# EAGLE design rpi_hat (EAGLE 9.6.1)
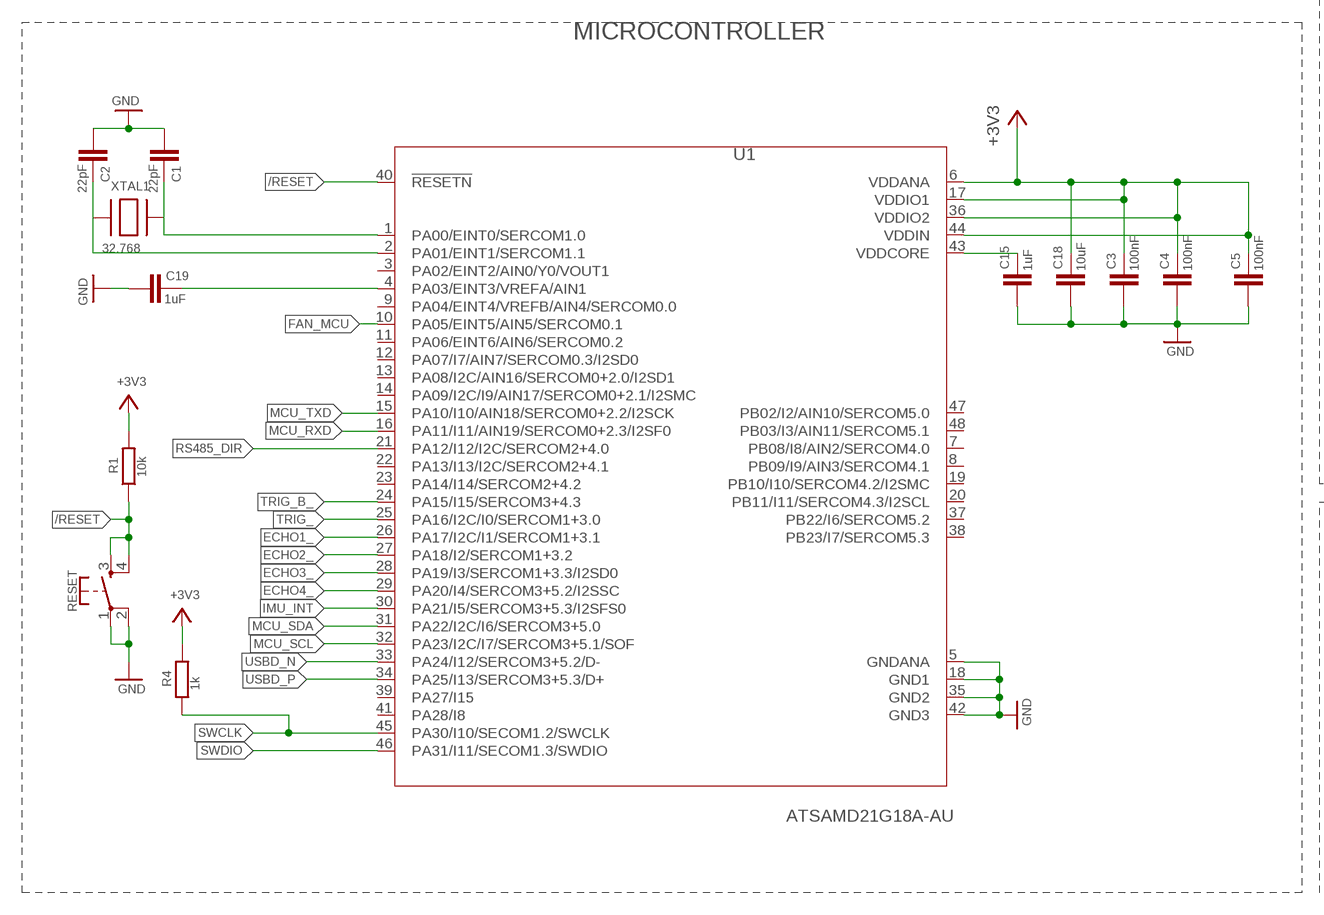
[diagram p0: schematic, sheet 1, part 1 of 2]
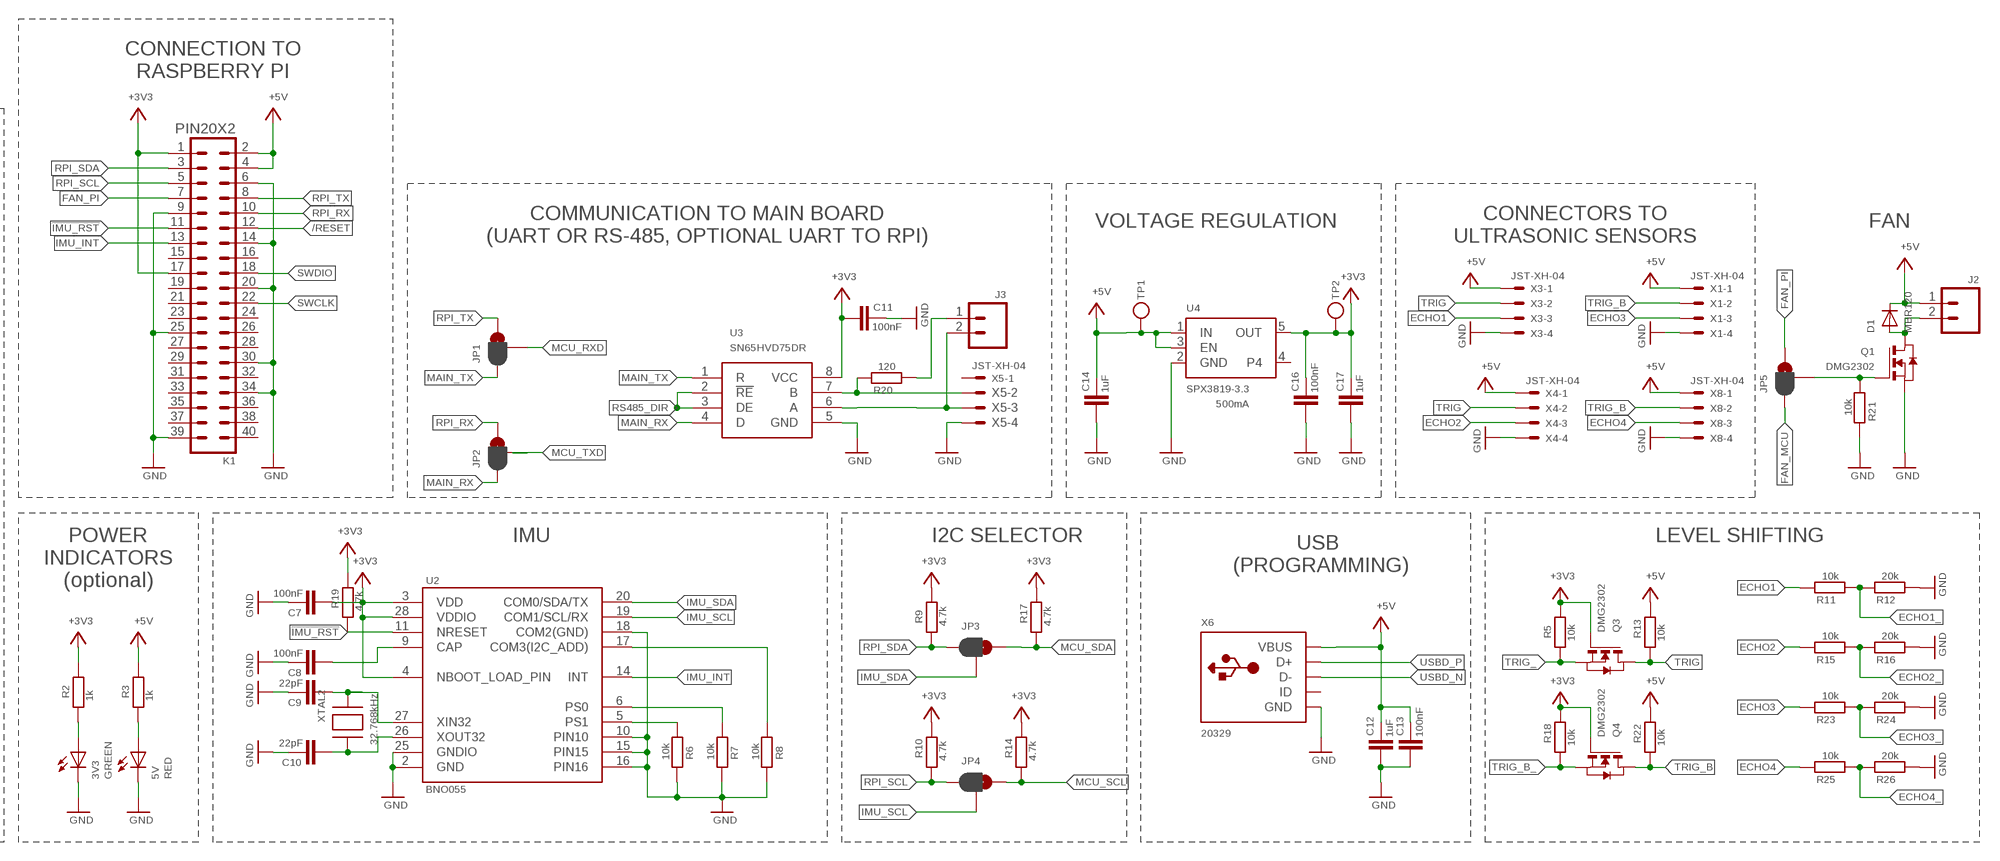
[diagram p1: schematic, sheet 1, part 2 of 2]

## Parts
3V3  GREEN  LEDCHIP-LED0603  [CHIP-LED0603]
5V  RED  LEDCHIP-LED0603  [CHIP-LED0603]
C1  22pF  C-EUC0402  [C0402]
C2  22pF  C-EUC0402  [C0402]
C3  100nF  C-EUC0402  [C0402]
C4  100nF  C-EUC0402  [C0402]
C5  100nF  C-EUC0402  [C0402]
C7  100nF  C-EUC0402  [C0402]
C8  100nF  C-EUC0402  [C0402]
C9  22pF  C-EUC0402  [C0402]
C10  22pF  C-EUC0402  [C0402]
C11  100nF  C-EUC0402  [C0402]
C12  1uF  C-EUC0402  [C0402]
C13  100nF  C-EUC0402  [C0402]
C14  1uF  C-EUC0402  [C0402]
C15  1uF  C-EUC0402  [C0402]
C16  100nF  C-EUC0402  [C0402]
C17  1uF  C-EUC0402  [C0402]
C18  10uF  C-EUC0402  [C0402]
C19  1uF  C-EUC0402  [C0402]
D1  MBR120  DIODESOD-123  [SOD-123]
J2  CONN_02  [1X02]
J3  CONN_02  [1X02]
JP1  SPARKFUN-PASSIVES_JUMPER_PAD-3-1&2_NC_BY_PASTE  [SPARKFUN-PASSIVES_PAD-HUMPER-3-1&2_NC_BY_PASTE_YES_SILK_FULL_BOX]
JP2  SPARKFUN-PASSIVES_JUMPER_PAD-3-1&2_NC_BY_PASTE  [SPARKFUN-PASSIVES_PAD-HUMPER-3-1&2_NC_BY_PASTE_YES_SILK_FULL_BOX]
JP3  SPARKFUN-PASSIVES_JUMPER_PAD-3-1&2_NC_BY_PASTE  [SPARKFUN-PASSIVES_PAD-HUMPER-3-1&2_NC_BY_PASTE_YES_SILK_FULL_BOX]
JP4  SPARKFUN-PASSIVES_JUMPER_PAD-3-1&2_NC_BY_PASTE  [SPARKFUN-PASSIVES_PAD-HUMPER-3-1&2_NC_BY_PASTE_YES_SILK_FULL_BOX]
JP5  SPARKFUN-PASSIVES_JUMPER_PAD-3-1&2_NC_BY_PASTE  [SPARKFUN-PASSIVES_PAD-HUMPER-3-1&2_NC_BY_PASTE_YES_SILK_FULL_BOX]
K1  PIN20X2  [PIN_20X2]
Q1  DMG2302  NMOS-SOT23  [SOT-23]
Q3  DMG2302  NMOS-SOT23  [SOT-23]
Q4  DMG2302  NMOS-SOT23  [SOT-23]
R1  10k  R-EU_R0402  [R0402]
R2  1k  R-EU_R0402  [R0402]
R3  1k  R-EU_R0402  [R0402]
R4  1k  R-EU_R0402  [R0402]
R5  10k  R-EU_R0402  [R0402]
R6  10k  R-EU_R0402  [R0402]
R7  10k  R-EU_R0402  [R0402]
R8  10k  R-EU_R0402  [R0402]
R9  4.7k  R-EU_R0402  [R0402]
R10  4.7k  R-EU_R0402  [R0402]
R11  10k  R-EU_R0402  [R0402]
R12  20k  R-EU_R0402  [R0402]
R13  10k  R-EU_R0402  [R0402]
R14  4.7k  R-EU_R0402  [R0402]
R15  10k  R-EU_R0402  [R0402]
R16  20k  R-EU_R0402  [R0402]
R17  4.7k  R-EU_R0402  [R0402]
R18  10k  R-EU_R0402  [R0402]
R19  4.7k  R-EU_R0402  [R0402]
R20  120  R-EU_R0402  [R0402]
R21  10k  R-EU_R0402  [R0402]
R22  10k  R-EU_R0402  [R0402]
R23  10k  R-EU_R0402  [R0402]
R24  20k  R-EU_R0402  [R0402]
R25  10k  R-EU_R0402  [R0402]
R26  20k  R-EU_R0402  [R0402]
RESET  MOMENTARY-SWITCH-SPST-2-SMD-4.6X2.8MM  [TACTILE_SWITCH_SMD_4.6X2.8MM]
TP1  MICROBUILDER_TESTPOINTROUND1MM  [MICROBUILDER_TESTPOINT_ROUND_1MM]
TP2  MICROBUILDER_TESTPOINTROUND1MM  [MICROBUILDER_TESTPOINT_ROUND_1MM]
U1  ATSAMD21G18A-AU  [QFP50P900X900X120-48N]
U2  BNO055  [LGA28R50P4X10_380X520X100]
U3  SN65HVD75DR  [SOIC127P600X175-8N]
U4  SPX3819-3.3  VREG_SOT23-5  [SOT23-5]
X1  JST-XH-04  JST-XH-04-PIN-ROUND-PAD  [JST-XH-04-PACKAGE-ROUND-PAD]
X3  JST-XH-04  JST-XH-04-PIN-ROUND-PAD  [JST-XH-04-PACKAGE-ROUND-PAD]
X4  JST-XH-04  JST-XH-04-PIN-ROUND-PAD  [JST-XH-04-PACKAGE-ROUND-PAD]
X5  JST-XH-04  JST-XH-04-PIN-ROUND-PAD  [JST-XH-04-PACKAGE-ROUND-PAD]
X6  20329  USB_MICRO_20329_V2  [4UCONN_20329_V2]
X8  JST-XH-04  JST-XH-04-PIN-ROUND-PAD  [JST-XH-04-PACKAGE-ROUND-PAD]
XTAL1  32.768  XTAL-3.2X1.5  [XTAL3215]
XTAL2  32.768kHz  ADAFRUIT2_XTAL-3.2X1.5  [ADAFRUIT2_XTAL3215]

## Nets
!IMU_RST: K1.11 R19.1 U2.11(NRESET)
+3V3: C3.1 C4.1 C5.1 C7.2 C11.2 C16.1 C17.1 C18.1 K1.1 K1.17 Q3.G Q4.G R1.2 R2.2 R4.2 R5.2 R9.2 R10.2 R14.2 R17.2 R18.2 R19.2 TP2.P$1 U1.6(VDDANA) U1.17(VDDIO1) U1.36(VDDIO2) U1.44(VDDIN) U2.3(VDD) U2.4(NBOOT_LOAD_PIN) U2.28(VDDIO) U3.8(VCC) U4.5(OUT)
+5V: C12.1 C13.1 C14.1 D1.C J2.1 K1.2 K1.4 R3.2 R13.2 R22.2 TP1.P$1 U4.1(IN) U4.3(EN) X1.1 X3.1 X4.1 X6.VBUS X8.1
/RESET: K1.12 R1.1 RESET.3 RESET.4 U1.40(!RESETN)
ECHO1: R11.2 X3.3
ECHO1_: R11.1 R12.2 U1.26(PA17/I2C/I1/SERCOM1+3.1)
ECHO2: R15.2 X4.3
ECHO2_: R15.1 R16.2 U1.27(PA18/I2/SERCOM1+3.2)
ECHO3: R23.2 X1.3
ECHO3_: R23.1 R24.2 U1.28(PA19/I3/SERCOM1+3.3/I2SD0)
ECHO4: R25.2 X8.3
ECHO4_: R25.1 R26.2 U1.29(PA20/I4/SERCOM3+5.2/I2SSC)
FAN_MCU: JP5.1 U1.10(PA05/EINT5/AIN5/SERCOM0.1)
FAN_PI: JP5.3 K1.7
GND: 3V3.C 5V.C C1.2 C2.2 C3.2 C4.2 C5.2 C7.1 C8.1 C9.1 C10.1 C11.1 C12.2 C13.2 C14.2 C15.2 C16.2 C17.2 C18.2 C19.2 K1.6 K1.9 K1.14 K1.20 K1.25 K1.30 K1.34 K1.39 Q1.S R6.2 R7.2 R8.2 R12.1 R16.1 R21.2 R24.1 R26.1 RESET.1 RESET.2 U1.5(GNDANA) U1.18(GND1) U1.35(GND2) U1.42(GND3) U2.2(GND) U2.10(PIN10) U2.15(PIN15) U2.16(PIN16) U2.18(COM2(GND)) U2.25(GNDIO) U3.5(GND) U4.2(GND) X1.4 X3.4 X4.4 X5.4 X6.BASE@1(GND) X6.BASE@2(GND) X6.GND X6.SPRT@1(GND) X6.SPRT@2(GND) X6.SPRT@3(GND) X6.SPRT@4(GND) X8.4
IMU_INT: K1.13 U1.30(PA21/I5/SERCOM3+5.3/I2SFS0) U2.14(INT)
IMU_SCL: JP4.2 U2.19(COM1/SCL/RX)
IMU_SDA: JP3.2 U2.20(COM0/SDA/TX)
MAIN_RX: JP2.1 U3.4(D)
MAIN_TX: JP1.1 U3.1(R)
MCU_RXD: JP1.2 U1.16(PA11/I11/AIN19/SERCOM0+2.3/I2SF0)
MCU_SCL: JP4.3 R14.1 U1.32(PA23/I2C/I7/SERCOM3+5.1/SOF)
MCU_SDA: JP3.3 R17.1 U1.31(PA22/I2C/I6/SERCOM3+5.0)
MCU_TXD: JP2.2 U1.15(PA10/I10/AIN18/SERCOM0+2.2/I2SCK)
N$1: J3.1 R20.1
N$2: C2.1 U1.2(PA01/EINT1/SERCOM1.1) XTAL1.P$1
N$3: C1.1 U1.1(PA00/EINT0/SERCOM1.0) XTAL1.P$2
N$4: C15.1 U1.43(VDDCORE)
N$5: JP5.2 Q1.G R21.1
N$6: D1.A J2.2 Q1.D
N$8: R6.1 U2.5(PS1)
N$9: R7.1 U2.6(PS0)
N$11: C19.1 U1.4(PA03/EINT3/VREFA/AIN1)
N$12: C8.2 U2.9(CAP)
N$13: C10.2 U2.26(XOUT32) XTAL2.P$1
N$14: C9.2 U2.27(XIN32) XTAL2.P$2
N$17: 3V3.A R2.1
N$18: R8.1 U2.17(COM3(I2C_ADD))
N$19: 5V.A R3.1
N$24: R20.2 U3.7(B) X5.2
N$29: J3.2 U3.6(A) X5.3
RPI_RX: JP2.3 K1.10
RPI_SCL: JP4.1 K1.5 R10.1
RPI_SDA: JP3.1 K1.3 R9.1
RPI_TX: JP1.3 K1.8
RS485_DIR: U1.21(PA12/I12/I2C/SERCOM2+4.0) U3.2(!RE) U3.3(DE)
SWCLK: K1.22 R4.1 U1.45(PA30/I10/SECOM1.2/SWCLK)
SWDIO: K1.18 U1.46(PA31/I11/SECOM1.3/SWDIO)
TRIG: Q3.D R13.1 X3.2 X4.2
TRIG_: Q3.S R5.1 U1.25(PA16/I2C/I0/SERCOM1+3.0)
TRIG_B: Q4.D R22.1 X1.2 X8.2
TRIG_B_: Q4.S R18.1 U1.24(PA15/I15/SERCOM3+4.3)
USBD_N: U1.33(PA24/I12/SERCOM3+5.2/D-) X6.D-
USBD_P: U1.34(PA25/I13/SERCOM3+5.3/D+) X6.D+
Unconnected: K1.15 K1.16 K1.19 K1.21 K1.23 K1.24 K1.26 K1.27 K1.28 K1.29 K1.31 K1.32 K1.33 K1.35 K1.36 K1.37 K1.38 K1.40 U1.3(PA02/EINT2/AIN0/Y0/VOUT1) U1.7(PB08/I8/AIN2/SERCOM4.0) U1.8(PB09/I9/AIN3/SERCOM4.1) U1.9(PA04/EINT4/VREFB/AIN4/SERCOM0.0) U1.11(PA06/EINT6/AIN6/SERCOM0.2) U1.12(PA07/I7/AIN7/SERCOM0.3/I2SD0) U1.13(PA08/I2C/AIN16/SERCOM0+2.0/I2SD1) U1.14(PA09/I2C/I9/AIN17/SERCOM0+2.1/I2SMC) U1.19(PB10/I10/SERCOM4.2/I2SMC) U1.20(PB11/I11/SERCOM4.3/I2SCL) U1.22(PA13/I13/I2C/SERCOM2+4.1) U1.23(PA14/I14/SERCOM2+4.2) U1.37(PB22/I6/SERCOM5.2) U1.38(PB23/I7/SERCOM5.3) U1.39(PA27/I15) U1.41(PA28/I8) U1.47(PB02/I2/AIN10/SERCOM5.0) U1.48(PB03/I3/AIN11/SERCOM5.1) U4.4 X5.1 X6.ID

## Notes on the sheet
- CONNECTION TO
  RASPBERRY PI
- MICROCONTROLLER
- VOLTAGE REGULATION | FAN
- COMMUNICATION TO MAIN BOARD
  (UART OR RS-485, OPTIONAL UART TO RPI)
- CONNECTORS TO
  ULTRASONIC SENSORS
- 500mA
- IMU | I2C SELECTOR | LEVEL SHIFTING
- USB 
  (PROGRAMMING)
- POWER
  INDICATORS
  (optional)

## Library data of the parts
3V3 5V = led:LED: LED OSRAM: - CHIPLED LG R971, LG N971, LY N971, LG Q971, LY Q971, LO R971, LY R971 LH N974, LH R974 LS Q976, LO Q976, LY Q976 LO Q996 - Hyper CHIPLED LW Q18S LB Q993, LB Q99A, LB R99A - SideLED LS A670, LO A670, LY A670, LG A670, LP A670 LB A673, LV A673, LT A673, LW A673 LH A674 LY A675 LS A676, LA A676, LO A676, LY A676, LW A676 LS A679, LY A679, LG A679 - Hyper Micro SIDELED® LS Y876, LA Y876, LO Y876, LY Y876 LT Y87S - SmartLED LW L88C, LW L88S LB L89C, LB L89S, LG L890 LS L89K, LO L89K, LY L89K LS L896, LA L896, LO L896, LY L896 - TOPLED LS T670, LO T670, LY T670, LG T670, LP T670 LSG T670, LSP T670, LSY T670, LOP T670, LYG T670 LG T671, LOG T671, LSG T671 LB T673, LV T673, LT T673, LW T673 LH T674 LS T676, LA T676, LO T676, LY T676, LB T676, LH T676, LSB T676, LW T676 LB T67C, LV T67C, LT T67C, LS T67K, LO T67K, LY T67K, LW E67C LS E67B, LA E67B, LO E67B, LY E67B, LB E67C, LV E67C, LT E67C LW T67C LS T679, LY T679, LG T679 LS T770, LO T770, LY T770, LG T770, LP T770 LB T773, LV T773, LT T773, LW T773 LH T774 LS E675, LA E675, LY E675, LS T675 LS T776, LA T776, LO T776, LY T776, LB T776 LHGB T686 LT T68C, LB T68C - Hyper Mini TOPLED® LB M676 - Mini TOPLED Santana® LG M470 LS M47K, LO M47K, LY M47K Source: http://www.osram.convergy.de LUXEON: - LUMILED® LXK2-PW12-R00, LXK2-PW12-S00, LXK2-PW14-U00, LXK2-PW14-V00 LXK2-PM12-R00, LXK2-PM12-S00, LXK2-PM14-U00 LXK2-PE12-Q00, LXK2-PE12-R00, LXK2-PE12-S00, LXK2-PE14-T00, LXK2-PE14-U00 LXK2-PB12-K00, LXK2-PB12-L00, LXK2-PB12-M00, LXK2-PB14-N00, LXK2-PB14-P00, LXK2-PB14-Q00 LXK2-PR12-L00, LXK2-PR12-M00, LXK2-PR14-Q00, LXK2-PR14-R00 LXK2-PD12-Q00, LXK2-PD12-R00, LXK2-PD12-S00 LXK2-PH12-R00, LXK2-PH12-S00 LXK2-PL12-P00, LXK2-PL12-Q00, LXK2-PL12-R00 Source: www.luxeon.com KINGBRIGHT: KA-3528ASYC Source: www.kingbright.com
C1-C5 C7-C19 = rcl:C-EU: CAPACITOR, European symbol; SPICEPREFIX: C
D1 = adafruit:DIODE: Diode SMADIODE - SMA Surface Mount Package 20V 1A Schottky Diode Digikey: 641-1014-6-ND DO-1N4148 - Through Hole Small Current Diode SOD-123 20V 1 A (.5mV Vf) Schottky Diode - Digikey: MBRX120TPMSCT-ND SOD-323 10V 570mA (.38mV Vf, 3ns) Schottky Diode - Digikey: ZLLS410CT-ND SOD-523 30V 30mA Schottky Diode (RB751S-40TE61) - Digikey: RB751S-40TE61CT-ND SOT23-R/W - SOT23 Package (R = Solder Paste/Reflow Ovens, W = Hand-Soldering) BAT54Film 40V 300mA - Digikey: 497-7162-1-ND
J2 J3 = SparkFun-Connectors:CONN_02: Multi connection point. Often used as Generic Header-pin footprint for 0.1 inch spaced/style header connections On any of the 0.1 inch spaced packages, you can populate with these: Break Away Headers - Straight <https://www.sparkfun.com/products/116> (PRT-00116) Break Away Male Headers - Right Angle <https://www.sparkfun.com/products/553> (PRT-00553) Female Headers <https://www.sparkfun.com/products/115> (PRT-00115) Break Away Headers - Machine Pin <https://www.sparkfun.com/products/117> (PRT-00117) Break Away Female Headers - Swiss Machine Pin <https://www.sparkfun.com/products/743> (PRT-00743) For SCREWTERMINALS and SPRING TERMINALS visit here: Screw Terimnals on SparkFun.com <https://www.sparkfun.com/search/results?term=Screw+Terminals> (5mm/3.5mm/2.54mm spacing) This device is also useful as a general connection point to wire up your design to another part of your project. Our various solder wires solder well into these plated through hole pads. Hook-Up Wire - Assortment (Stranded, 22 AWG) <https://www.sparkfun.com/products/11375> (PRT-11375) Hook-Up Wire - Assortment (Solid Core, 22 AWG) <https://www.sparkfun.com/products/11367> (PRT-11367) View the entire wire category on our website here <https://www.sparkfun.com/categories/141> Special notes: Molex polarized connector foot print use with: PRT-08233 with associated crimp pins and housings. 2.54_SCREWTERM for use with PRT-10571. 3.5mm Screw Terminal footprints for PRT-08084 5mm Screw Terminal footprints for use with PRT-08432
JP1-JP5 = SparkFun_MPU-9250_Breakout:SPARKFUN-PASSIVES_JUMPER_PAD-3-1&2_NC_BY_PASTE
K1 = FLYFISH:PIN20X2
Q1 Q3 Q4 = MOSFET:NMOS: N-Channel MOSFET
R1-R26 = rcl:R-EU_: RESISTOR, European symbol; SPICEPREFIX: R
RESET = SparkFun-Switches:MOMENTARY-SWITCH-SPST-2: Momentary Switch (Pushbutton) - SPST - Two Circuits Normally-open (NO) SPST momentary switches (buttons, pushbuttons). Schematic symbol includes two switch circuits. Variants SMD-4.6MMX2.8MM - 4.60mm x 2.80mm Tactile Momentary Button Switch - Used on SparkFun SAMD21 Mini Breakout <https://www.sparkfun.com/products/13664> SMD-5.2MM - Mini Pushbutton Switch - SMD <https://www.sparkfun.com/products/8720> - Used on Arduino Pro Mini <https://www.sparkfun.com/products/11114>; PROD_ID: SWCH-13065
TP1 TP2 = Adafruit Feather M0 Basic rev C:MICROBUILDER_TESTPOINT: Test Point Various test points for characterisation and PCB testing TESTPOINT_SMT - Compact Surface Mount Test Point [Digikey: 5016KTR-ND]
U1 = ATSAMD21G18A-AU:ATSAMD21G18A-AU: Cortex-M0+, 256KB FLASH, 32KB SRAM, USB, DMA, T&R - 48TQFP IND TEMP, GREEN, 1.6-3.6V, 48MHz; AVAILABILITY: Unavailable; DESCRIPTION: SAMD21G Series 256 kB Flash 32 kB SRAM 48 MHz 32-Bit Microcontroller - TQFP-48; MF: Microchip; MP: ATSAMD21G18A-AU; PACKAGE: TQFP-48 Microchip; PRICE: None
U2 = BNO055:BNO055: BNO055 9-axis Absolute Orientation Sensor ( SiP ) w/Sensors and Sensor Fusion; AVAILABILITY: Unavailable; DESCRIPTION: Accelerometer, Gyroscope, Magnetometer, 9 Axis Sensor I²C, UART Output; MF: Bosch; MP: BNO055; PACKAGE: LGA-28 Bosch; PRICE: None
U3 = SN65HVD75DR:SN65HVD75DR: 3.3-V half-duplex RS-485 transceiver with IEC ESD, 20 Mbps Source: Datasheet <http://www.ti.com/lit/gpn/sn65hvd75>; AVAILABILITY: Unavailable; DESCRIPTION: 1/1 Transceiver Half RS422, RS485 8-SOIC; MF: Texas Instruments; MP: SN65HVD75DR; PACKAGE: SOIC-8 Texas Instruments; PRICE: None
U4 = microbuilder:VREG_SOT23-5: SOT23-5 Fixed Voltage Regulators Part Current Out V Out V In V Dropout θJA (°C/W) TJ (°C) Digikey Part No. ADP121 150mA 3.3V 3.4-5.5V 0.09V @ 150mA -- -- ADP121-AUJZ33R7CT-ND ADP121 150mA 3.0V 3.1-5.5V 0.09V @ 150mA -- -- ADP121-AUJZ30R7CT-ND ADP122 300mA 3.3V 3.4-5.5V 0.085V @ 300mA -- -- ADP122AUJZ-3.3-R7CT-ND ADP1712 300mA 3.3V 3.5-5.5V 0.17V @ 300mA -- -- ADP1712AUJZ-3.3-R7TR-ND AP7311 (Low Cost) 150mA 3.3V 3.5-6V 0.15V @ 150mA -- -- AP7311-33WG-7DICT-ND LD39015M18R 150mA 1.8V 1.9V-5.5V 0.08V @ 100mA -- -- 497-6977-1-ND LP2985A-33DBVR 150mA 3.3V 3.3-16V 0.28V @ 150mA 206 150 296-18479-1-ND MCP1824T-3302E/OT 300mA 3.3V 3.5V-6V 0.2V @ 300mA -- -- MCP1824T-3302E/OTCT-ND MIC5205-2.5YM5 TR 150mA 2.5V 2.7-16V 0.165V @ 150mA -- -- 576-1257-2-ND MIC5205-3.0YM5 TR 150mA 3.0V 3.2V-16V 0.165V @ 150mA -- -- 576-1258-2-ND MIC5205-3.3YM5 TR 150mA 3.3V 3.5V-16V 0.165V @ 150mA -- -- 576-1259-2-ND TPS780330220 150mA 3.3V+2.2V 3.6-5.5V 250mV Max -- -- 296-23332-1-ND TDA3663/N1,135 100mA 3.3V 3.5-45V 0.18V @ 50mA -- -- 568-5343-1-ND Max operating temp can be calculated using θJA, TJ (max junction temperature), and power in watts. Set the "Maximum Ambient Temperature" until it reaches TJ ("Max Junction Temperature"), which is the absolute limit for safe use of the regulator: Heat Sink Temperature Calculator <http://www.daycounter.com/Calculators/Heat-Sink-Temperature-Calculator.phtml> For example, With 12V source into a 3.3V LP2985 and a 30mA load, we are dissipating (12V-3.3V) * 0.03A = 0.261W. With a θJA of 206 °C/W, a TJ of 150°C, and 261mW we can safely use the chip without a heat sink up to 75°C (=147.1°C Junction Temperature).
X1 X3-X5 X8 = con-jst-xh:JST-XH-04-PIN: JST XH Connector 2 Pin Wire to board connector. Pitch: 2,54 mm, (0.100") Number of pins: 4 Created by Rembrandt Electronics www.rembrandtelectronics.com
X6 = microbuilder:USB: USB Connectors USBMINIB - Surface Mount Female Mini-B USB Connector 4UConnector: 06564
XTAL1 = adafruit2:XTAL: Low cost SMT crystals, no capacitors included http://www.ladyada.net/library/eagle
XTAL2 = Adafruit Feather M0 Basic rev C:ADAFRUIT2_XTAL: Low cost SMT crystals, no capacitors included http://www.ladyada.net/library/eagle

## Board
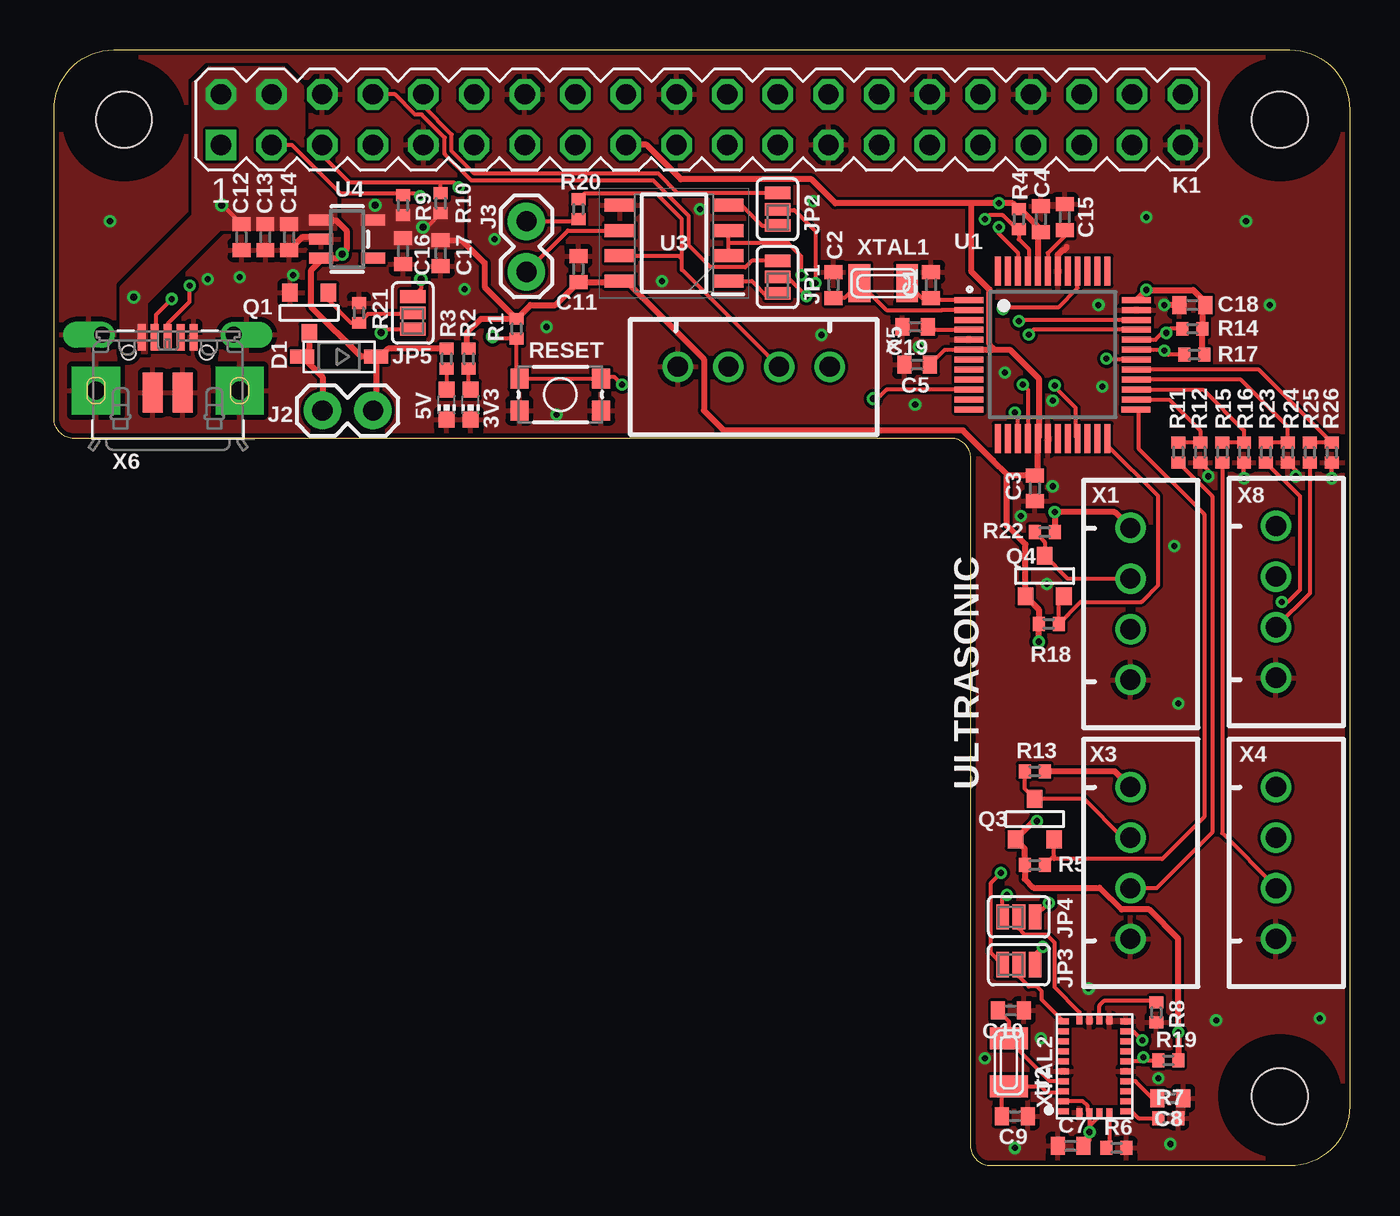
[diagram p2: board, top side]
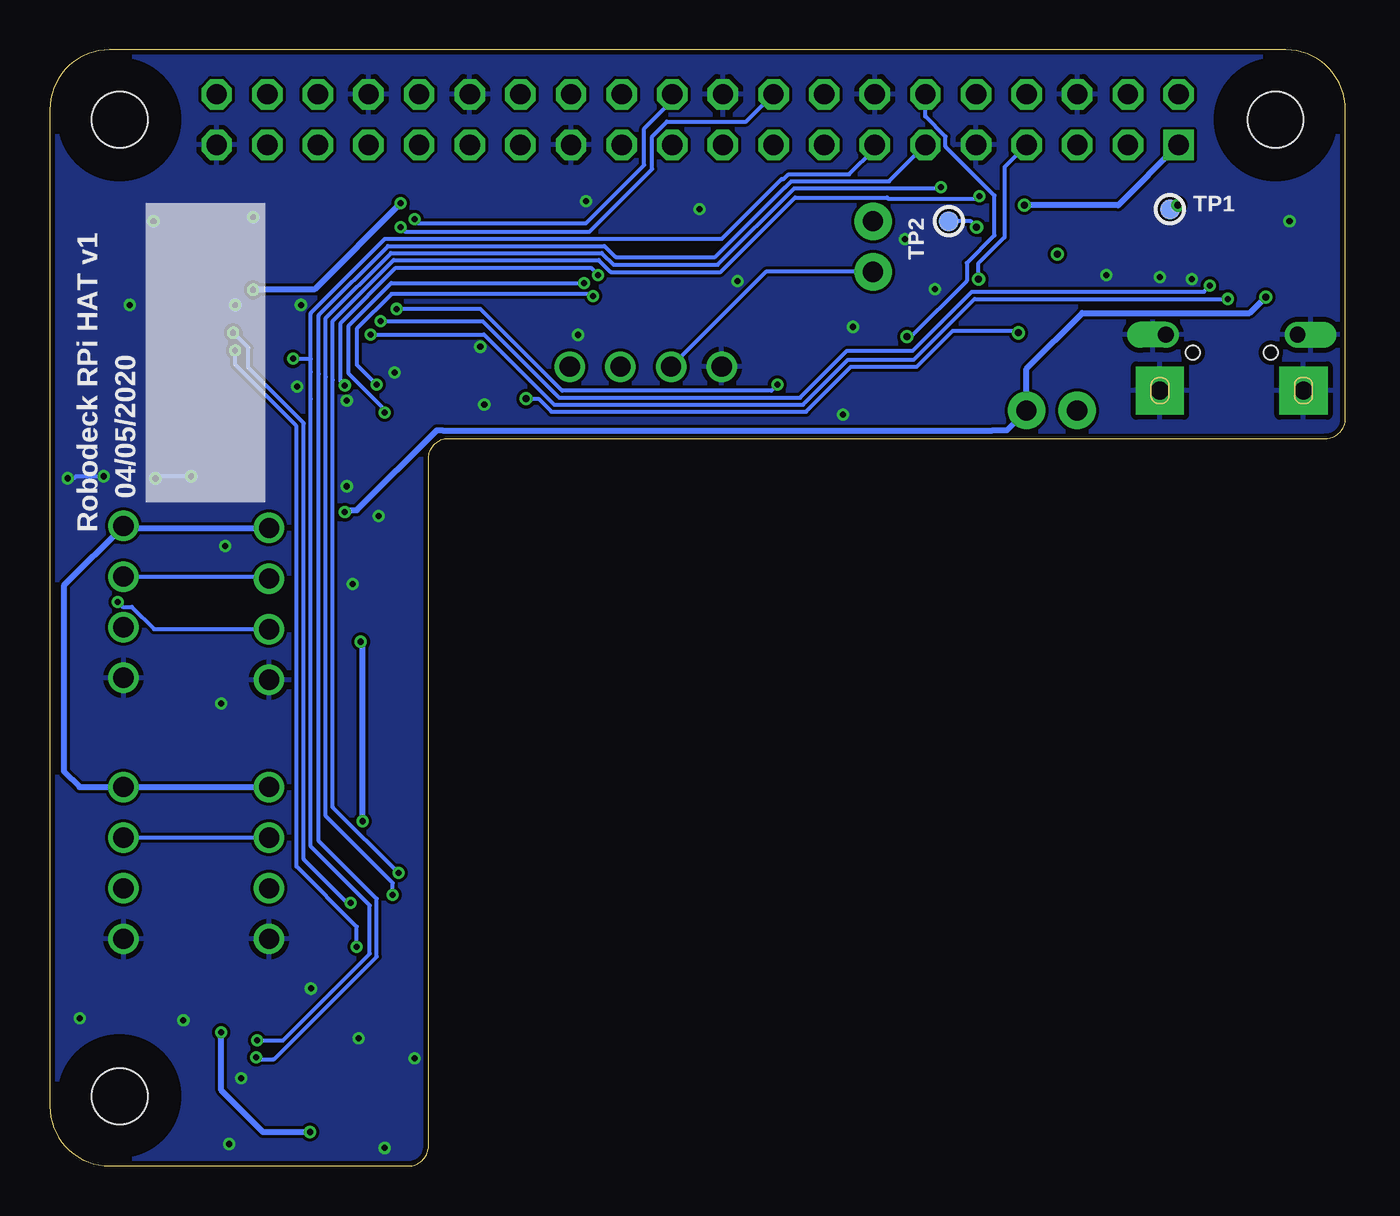
[diagram p3: board, bottom side, seen from below]

Size 65 x 56 mm. Coordinates in mm from the lower left corner, seen from the top.
Outline: 46,35.5 arc90 45,36.5 1,36.5 arc-90 0,37.5 0,53 arc-90 3,56 62,56 arc-90 65,53 65,3 arc-90 62,0 47,0 arc-90 46,1 46,19 46,35.5
Outline: 2,39.55 arc90 1.65,39.2 1.65,38.65 arc90 2,38.25 2.2,38.25 arc90 2.55,38.65 2.55,39.2 arc90 2.2,39.55 2,39.55
Outline: 9.75,39.2 arc90 9.3,39.55 arc90 8.85,39.2 8.85,38.6 arc90 9.3,38.25 arc90 9.75,38.6 9.75,39.2
Copper layers (1*16): Top 0.035mm / dielectric 1.5mm / Bottom 0.035mm
Design rules "ITEADstudio_DRC": minimum track width 6mil, minimum drill 12mil, track to track 6mil, track to pad 6mil, pad to pad 6mil, via to via 6mil, smd to smd 0mil, copper to edge 10mil, drill to drill 10mil, minimum pad ring 10mil, minimum via ring 6mil, stop-mask expansion 2mil, vias tented up to drill 100mil, thermal gap 10mil
Holes 2.8 mm at 3.5,52.5 61.5,52.5 61.5,3.5
tRestrict: area 1.9,51 to 5,54; area 60,51 to 63,54; area 60,1.9 to 63,5
bRestrict: area 1.9,51 to 5,54; area 60,1.9 to 63,5; area 60,51 to 63,54

### Footprints (pad centres in the part's own frame; a part is rotated, then mirrored left to right if it is on the bottom)
CHIP-LED0603 = smd 0.8 x 0.8: A 0,-0.75; C 0,0.75
C0402 = smd 0.7 x 0.9: 1 -0.65,0; 2 0.65,0
SOD-123 = smd 1.2 x 0.7: A 1.85,0; C -1.85,0
1X02 = drill 1.016 pad 1.88: 1 0,0; 2 2.54,0
SPARKFUN-PASSIVES_PAD-HUMPER-3-1&2_NC_BY_PASTE_YES_SILK_FULL_BOX = smd 0.635 x 1.27: 1 -0.813,0; 2 0,0; 3 0.813,0
PIN_20X2 = drill 1.016 square: 1 -24.13,-1.27 | drill 1.016 octagon: 2 -24.13,1.27; 3 -21.59,-1.27; 4 -21.59,1.27; 5 -19.05,-1.27; 6 -19.05,1.27; 7 -16.51,-1.27; 8 -16.51,1.27; 9 -13.97,-1.27; 10 -13.97,1.27; 11 -11.43,-1.27; 12 -11.43,1.27; 13 -8.89,-1.27; 14 -8.89,1.27; 15 -6.35,-1.27; 16 -6.35,1.27; 17 -3.81,-1.27; 18 -3.81,1.27; 19 -1.27,-1.27; 20 -1.27,1.27; 21 1.27,-1.27; 22 1.27,1.27; 23 3.81,-1.27; 24 3.81,1.27; 25 6.35,-1.27; 26 6.35,1.27; 27 8.89,-1.27; 28 8.89,1.27; 29 11.43,-1.27; 30 11.43,1.27; 31 13.97,-1.27; 32 13.97,1.27; 33 16.51,-1.27; 34 16.51,1.27; 35 19.05,-1.27; 36 19.05,1.27; 37 21.59,-1.27; 38 21.59,1.27; 39 24.13,-1.27; 40 24.13,1.27
SOT-23 = smd 0.787 x 0.889: D 0,1.016; G -0.965,-1.016; S 0.965,-1.016
R0402 = smd 0.6 x 0.7: 1 -0.5,0; 2 0.5,0
TACTILE_SWITCH_SMD_4.6X2.8MM = smd 0.9 x 1: 1 -2.05,-0.8; 2 2.05,-0.8; 3 2.05,0.8; 4 -2.05,0.8
MICROBUILDER_TESTPOINT_ROUND_1MM = smd 1 x 1: P$1 0,0
QFP50P900X900X120-48N = smd 1.45 x 0.3: 1 -4.2,2.75; 2 -4.2,2.25; 3 -4.2,1.75; 4 -4.2,1.25; 5 -4.2,0.75; 6 -4.2,0.25; 7 -4.2,-0.25; 8 -4.2,-0.75; 9 -4.2,-1.25; 10 -4.2,-1.75; 11 -4.2,-2.25; 12 -4.2,-2.75; 25 4.17,-2.75; 26 4.2,-2.25; 27 4.2,-1.75; 28 4.2,-1.25; 29 4.2,-0.75; 30 4.2,-0.25; 31 4.2,0.25; 32 4.2,0.75; 33 4.2,1.25; 34 4.2,1.75; 35 4.2,2.25; 36 4.2,2.75 | smd 0.3 x 1.45: 13 -2.75,-4.2; 14 -2.25,-4.2; 15 -1.75,-4.2; 16 -1.25,-4.2; 17 -0.75,-4.2; 18 -0.25,-4.2; 19 0.25,-4.2; 20 0.75,-4.2; 21 1.25,-4.2; 22 1.75,-4.2; 23 2.25,-4.2; 24 2.75,-4.2; 37 2.75,4.2; 38 2.25,4.2; 39 1.75,4.2; 40 1.25,4.2; 41 0.75,4.2; 42 0.25,4.2; 43 -0.25,4.2; 44 -0.75,4.2; 45 -1.25,4.2; 46 -1.75,4.2; 47 -2.25,4.2; 48 -2.75,4.2
LGA28R50P4X10_380X520X100 = smd 0.3 x 0.525: 1 -2.25,1.562; 6 -2.25,-1.562; 7 -1.75,-1.562; 8 -1.25,-1.562; 9 -0.75,-1.562; 10 -0.25,-1.562; 11 0.25,-1.562; 12 0.75,-1.562; 13 1.25,-1.562; 14 1.75,-1.562; 15 2.25,-1.562; 20 2.25,1.562; 21 1.75,1.562; 22 1.25,1.562; 23 0.75,1.562; 24 0.25,1.562; 25 -0.25,1.562; 26 -0.75,1.562; 27 -1.25,1.562; 28 -1.75,1.562 | smd 0.425 x 0.3: 2 -2.312,0.75; 3 -2.312,0.25; 4 -2.312,-0.25; 5 -2.312,-0.75; 16 2.312,-0.75; 17 2.312,-0.25; 18 2.312,0.25; 19 2.312,0.75
SOIC127P600X175-8N = smd 1.528 x 0.65: 1 -2.711,1.905; 2 -2.711,0.635; 3 -2.711,-0.635; 4 -2.711,-1.905; 5 2.711,-1.905; 6 2.711,-0.635; 7 2.711,0.635; 8 2.711,1.905
SOT23-5 = smd 0.55 x 1.2: 1 -0.95,-1.3; 2 0,-1.3; 3 0.95,-1.3; 4 0.95,1.3; 5 -0.95,1.3
JST-XH-04-PACKAGE-ROUND-PAD = drill 1.016: 1 -3.81,0; 2 -1.27,0; 3 1.27,0; 4 3.81,0
4UCONN_20329_V2 = smd 1 x 2: BASE@1 -0.75,-2; BASE@2 0.75,-2 | smd 0.4 x 1.35: D+ 0,0.775; D- -0.65,0.775; GND 1.3,0.775; ID 0.65,0.775; VBUS -1.3,0.775 | drill 0.8 pad 1.143 offset: SPRT@1 -3.3,0.9; SPRT@2 3.3,0.9 | drill 0.9 pad 2.413 square: SPRT@3 -3.6,-1.9; SPRT@4 3.6,-1.9 | hole 0.7: -1.95,0; 1.95,0
XTAL3215 = smd 1.1 x 1.9: P$1 1.2,0; P$2 -1.2,0
ADAFRUIT2_XTAL3215 = smd 1.1 x 1.9: P$1 1.2,0; P$2 -1.2,0

### Placement (x,y rotation side)
3V3  20.9,38.2 180 top
5V  19.7,38.2 180 top
C1  44,44.2 90 top
C2  39.1,44.2 90 top
C3  49.2,34 270 top
C4  49.5,47.5 90 top
C5  43.3,40.2 180 top
C7  51,1 0 top
C8  56,3.4 180 top
C9  48.2,2.5 180 top
C10  48,7.8 180 top
C11  26.3,45 270 top
C12  9.4,46.6 270 top
C13  10.6,46.6 270 top
C14  11.8,46.6 270 top
C15  50.7,47.6 90 top
C16  17.5,45.9 270 top
C17  19.4,45.8 270 top
C18  57.1,43.2 180 top
C19  43.2,42.1 180 top
D1  14.3,40.6 180 top
J2  16,37.9 180 top
J3  23.7,47.4 270 top
JP1  36.3,44.6 90 top
JP2  36.3,48 90 top
JP3  48.4,10.1 0 top
JP4  48.4,12.5 0 top
JP5  18,42.8 90 top
K1  32.5,52.5 0 top
Q1  12.8,42.8 180 top
Q3  49.2,17.4 0 top
Q4  49.7,29.6 0 top
R1  23.2,42 90 top
R2  20.8,40.5 90 top
R3  19.7,40.5 90 top
R4  48.4,47.5 90 top
R5  49.2,15.1 180 top
R6  53.3,0.9 0 top
R7  55.9,2.4 0 top
R8  55.3,7.7 270 top
R9  17.5,48.2 270 top
R10  19.4,48.3 270 top
R11  56.4,35.8 270 top
R12  57.5,35.8 90 top
R13  49.2,19.8 0 top
R14  57.1,42 0 top
R15  58.6,35.8 270 top
R16  59.7,35.8 90 top
R17  57.2,40.7 0 top
R18  49.9,27.2 180 top
R19  55.9,5.3 0 top
R20  26.3,48 90 top
R21  15.3,42.8 90 top
R22  49.7,31.8 0 top
R23  60.8,35.8 270 top
R24  61.9,35.8 90 top
R25  63,35.8 270 top
R26  64.1,35.8 90 top
RESET  25.4,38.7 0 top
TP1  8.8,48 0 bottom
TP2  19.9,47.4 0 bottom
U1  50.1,40.7 0 top
U2  52.2,5 90 top
U3  31.1,46.3 180 top
U4  14.7,46.5 270 top
X1  54,28.2 270 top
X3  54,15.2 270 top
X4  61.3,15.2 270 top
X5  35.1,40.1 180 top
X6  5.7,40.8 0 top
X8  61.3,28.3 270 top
XTAL1  41.6,44.3 180 top
XTAL2  47.9,5.2 90 top

### Tracks (layer width: path | path; a pad name or v marks a point on that pad's centre or on a via)
!IMU_RST  (via drill 0.3)
  Top 0.2: U2.11 54.45,5.25 v54.65,5.45 54.65,5.3 R19.1
  Bottom 0.2: v54.65,5.45 54.55,5.35 53.75,5.35 48.6,10.5 48.6,13.4 51.51,16.31 51.51,39.74 51.51,42.69 48.03,46.16 37.17,46.16 36.61,45.6 31.62,45.6 28.12,49.1 28.1,49.1 27.79,49.41 24.8,49.41 22.89,49.41 K1.11
+3V3  (via drill 0.3, 0.35)
  Top 0.2: 28.5,44.35 28.85,44.35 | U2.28 51.61,3.25 51.85,3 51.85,2.79 U2.3 51.95,2 | 51.95,2 v51.95,1.7 51.95,1.3 C7.2 | U2.4 52.45,2.5 51.95,2 | U1.6 44.7,40.95 C5.1 | R10.2 18.7,47.1 v18.5,47.1
  Top 0.305: R19.2 v56.4,6.7 56.4,11.4 54.94,12.86 53.56,12.86 52.46,13.96 49.14,13.96 48.7,14.4 R5.2 48.7,15.92 Q3.G 49.15,17.3 v49.3,17.3 | v49.4,26.3 R18.2 49.4,27.92 Q4.G 48.73,31.18 47.8,32.12 47.8,34.7 | U1.6 47.2,40.95 | 47.2,40.95 47.95,40.95 49.4,39.51 49.4,36.55 U1.17 49.35,34.8 C3.1 47.85,34.65 47.8,34.7 | U1.44 49.35,44.7 49.35,46.7 C4.1 49.5,46.98 48.48,48 R4.2 48.1,48.3 v47.4,48.3 46,48.3 | U1.36 v54.8,43.95 57.15,43.95 57.75,43.35 C18.1 57.6,43.05 R14.2 57.6,40.8 R17.2 | C17.1 20.45,46.45 21.6,45.3 21.6,44.1 R1.2 | 28.2,44.35 C11.2 25.15,43.2 23.9,43.2 R1.2 | 28.2,44.35 28.5,44.35 | K1.17 29.72,51.23 31.45,49.5 38,49.5 39.2,48.3 46,48.3 | 47.2,40.95 46.93,41.22 46.93,43.97 46,44.9 46,48.3 | 47.8,34.7 47.1,35.4 45.6,36.9 33.6,36.9 32.6,37.9 32.6,40.48 28.69,44.4 U3.8 28.25,44.4 28.2,44.35 | R1.2 21.4,42.5 20.7,41.8 20.7,41.1 R2.2
  Bottom 0.2: v18.5,47.1 18.8,47.4 TP2.P$1
  Bottom 0.305: K1.1 11.4,48.2 v16.1,48.2 | v51.95,1.7 54.3,1.7 56.4,3.8 v56.4,6.7 | v49.3,17.3 49.3,26.2 v49.4,26.3 | v47.4,48.3 51.7,44 54.76,44 v54.8,43.95
  pour Top (no thermals): 14.5,49 14.5,46.1 20.5,46.1 20.5,49
+5V  (via drill 0.3, 0.35)
  Top 0.2: C12.1 8.45,48.2 v8.4,48.2
  Top 0.305: 14.15,47.45 U4.1 14.15,47.45 | 14.15,47.45 14.7,46.9 14.7,46 v14.45,45.75 14.25,45.55 13.5,45.55 | U4.3 13.5,45.55 | X1.1 53.21,32.8 v50.2,32.8 R22.2 | X3.1 53.21,19.8 R13.2 | 16.15,40.4 D1.C 15.4,40.6 12.9,43.1 12.9,44.95 13.5,45.55 | 16.15,40.4 16.15,38.05 J2.1 | R3.2 16.75,41 16.15,40.4
  Bottom 0.2: v8.4,48.2 8.6,48.2 TP1.P$1
  Bottom 0.305: X1.1 61.2,32.01 X8.1 64.3,29.11 64.3,19.8 63.51,19.01 X3.1 X4.1 | v50.2,32.8 50.1,32.9 49.6,32.9 45.59,36.91 45.3,36.91 17.7,36.91 16.99,36.91 J2.1 16,40 13.2,42.8 4.8,42.8 v4,43.6
  pour Top (no thermals): 3.4,44.1 7,47.7 7,54.3 7.8,55.1 11.5,55.1 12.5,54.1 12.5,50.6 14.1,49 14.1,47 8.3,47 4.6,43.3 4.6,40.8 3.4,40.8
/RESET  (via drill 0.3, 0.35)
  Top 0.2: v28.5,39.2 28.12,39.58 27.45,39.58 RESET.3 23.1,39.5 RESET.4 23.2,39.65 R1.1 22.1,41.5 v22,41.6 | v47.6,43 47.7,43.1 50.4,43.1 51.35,44.05 U1.40
  Bottom 0.2: v47.6,43 43.4,43 39.3,38.9 28.8,38.9 v28.5,39.2 | v22,41.6 21.8,41.6 19,44.4 19,45.3 17.6,46.7 17.6,48.69 20.06,51.14 20.06,51.65 21.07,52.66 K1.12
ECHO1
  Top 0.2: R11.2 58.1,33.6 58.1,16.73 55.3,13.93 X3.3
ECHO1_
  Top 0.2: U1.26 55.95,38.45 57.5,36.9 R12.2 R11.1
ECHO2
  Top 0.2: R15.2 58.6,16.7 61.3,14 X4.3
ECHO2_
  Top 0.2: U1.27 57.65,38.95 59.7,36.9 R16.2 R15.1
ECHO3  (via drill 0.3)
  Top 0.2: R23.2 62.5,33.6 62.5,28.9 61.9,28.3 v61.6,28.3
  Bottom 0.2: v61.6,28.3 61.34,28.04 60.88,28.04 59.77,26.93 X1.3
ECHO3_
  Top 0.2: U1.28 59.55,39.45 61.9,37.1 R24.2 R23.1
ECHO4
  Top 0.2: R25.2 63,28.73 X8.3
ECHO4_
  Top 0.2: U1.29 60.45,39.95 R26.2 R25.1
FAN_MCU  (via drill 0.35)
  Top 0.2: v41.11,38.49 41.31,38.49 41.77,38.95 U1.10 | v16.4,41.8 16.59,41.99 JP5.1
  Bottom 0.2: 27.06,37.84 26.95,37.95 | 26.95,37.95 26.6,38.3 24.81,40.09 21.51,40.09 19.8,41.8 19.7,41.9 16.5,41.9 v16.4,41.8 | 27.06,37.84 26.95,37.95 | 27.06,37.84 39.84,37.84 40.49,38.49 v41.11,38.49
FAN_PI  (via drill 0.35)
  Top 0.2: v18.4,44.5 18.4,44.01 JP5.3
  Bottom 0.2: 15.99,51.21 K1.7 17.1,50.12 17.1,46.6 18.4,45.3 v18.4,44.5
GND  (via drill 0.3)
  Top 0.2: R12.1 57.9,34.9 v57.9,34.6 | v59.7,34.5 R16.1 | R24.1 62.3,34.9 v62.3,34.6 | v64.1,34.5 R26.1
  Top 0.305: C18.2 v55.7,43.2 | C14.2 12.45,46.6 13.3,46.6 U4.2 | 50.8,46.1 50.63,45.93 50.57,45.93 50.35,45.71 U1.42
  Bottom 0.2: v57.9,34.6 59.6,34.6 v59.7,34.5 | v62.3,34.6 63.7,34.6 63.8,34.5 v64.1,34.5
  other vias: 25.2,37.7 7.7,44.5 12,44.7 9.3,44.6 22.1,46.5 24.7,42.1 30.5,44.4 32.4,48 38.1,48.4 38.5,41.7 43.2,38.2 47.7,39.8 50.1,38.4 50.1,34.1 48.5,32.6 49.8,29.2 56.2,31.1 52.6,39.1 52.4,43.2 54.8,47.6 59.8,47.4 61,43.2 56.4,23.2 58.3,7.3 46.7,5.4 48.2,0.9 56,1.1 63.5,7.4 49.5,6.4 51.9,8.9 55.4,4.4 43.4,41.1 2.8,47.4 20.6,44
  pour Bottom: 1,36.5 44.9,36.5 arc-90 46,35.4 46,1 arc90 47,0 62,0 arc90 65,3 65,53 arc90 62,56 3,56 arc90 0,53 0,37.5 arc90
  pour Top (rank 2): 1,36.5 44.9,36.5 arc-90 46,35.4 46,1 arc90 47,0 62,0 arc90 65,3 65,53 arc90 62,56 3,56 arc90 0,53 0,37.5 arc90
IMU_INT  (via drill 0.3)
  Top 0.2: U2.14 54.15,6.75 v54.6,6.3 | U1.30 52.85,40.45 v52.8,40.5
  Bottom 0.2: v54.6,6.3 53.3,6.3 48.95,10.65 48.95,13.07 51.91,16.03 51.91,38.49 51.91,39.83 51.91,40.5 | K1.13 23.61,51.05 24.9,49.76 27.94,49.76 28.18,49.51 28.29,49.51 31.29,46.51 48.18,46.51 51.91,42.78 51.91,40.5 | v52.8,40.5 51.91,40.5
IMU_SCL
  Top 0.2: U2.19 51.45,7.71 50.2,8.96 50.2,11.2 49.8,11.6 48.71,11.6 48.4,11.91 JP4.2
IMU_SDA
  Top 0.2: U2.20 49.55,8.34 49.55,8.76 49.3,9 48.9,9 48.4,9.5 JP3.2
MAIN_RX
  Top 0.2: U3.4 34.49,48.2 35.5,47.19 JP2.1
MAIN_TX
  Top 0.2: U3.1 35.01,44.4 35.8,43.6 36.11,43.6 JP1.1
MCU_RXD  (via drill 0.3)
  Top 0.2: JP1.2 36.8,44.6 v37.75,43.65 | U1.16 48.86,38.94 v48.6,39.2
  Bottom 0.2: v37.75,43.65 37.84,43.74 47.86,43.74 49.6,42 49.6,40.2 v48.6,39.2
MCU_SCL  (via drill 0.3)
  Top 0.2: JP4.3 49.21,12.51 v49.9,13.2 | U1.32 55.25,41.45 55.6,41.8 v55.8,41.8 56,42 R14.1
  Bottom 0.2: v55.8,41.8 55.05,41.05 55.05,40.05 52.26,37.26 52.26,15.38 50.08,13.2 v49.9,13.2
MCU_SDA  (via drill 0.3)
  Top 0.2: v49.6,11 49.2,10.61 49.21,10.6 JP3.3 | U1.31 55.65,40.95 v55.7,40.9 55.9,40.7 R17.1
  Bottom 0.2: v49.6,11 49.6,12 52.62,15.02 52.62,37.12 55.7,40.2 v55.7,40.9
MCU_TXD  (via drill 0.3)
  Top 0.2: JP2.2 36.34,47.96 37.14,47.96 38.2,46.9 v38.2,44.3 | U1.15 48.35,37.65 v48.2,37.8
  Bottom 0.2: v48.2,37.8 48.2,37.95 50,39.75 50,42.17 47.87,44.3 v38.2,44.3
N$1
  Top 0.2: J3.1 26.2,47.4 R20.1
N$2
  Top 0.2: U1.2 44.56,42.95 44.55,42.95 41.75,42.95 XTAL1.P$1 39.65,43.55 C2.1
N$3
  Top 0.2: U1.1 44.1,43.45 C1.1 43.55,43.55 XTAL1.P$2
N$4
  Top 0.2: C15.1 50.7,46.65 49.85,45.8 U1.43
N$5
  Top 0.2: JP5.2 17.95,42.75 15.75,42.75 R21.1 14.9,42.3 13.77,43.44 Q1.G
N$6
  Top 0.2: 12.47,40.62 D1.A
  Top 0.305: Q1.D 12.8,40.95 12.47,40.62 | D1.A 13.46,39.59 J2.2
N$8
  Top 0.2: U2.5 52.95,1.05 R6.1
N$9
  Top 0.2: U2.6 54.05,2.75 54.4,2.4 R7.1
N$11
  Top 0.2: C19.1 44,41.95 U1.4
N$12
  Top 0.2: C8.2 55.1,3.4 54.25,4.25 U2.9
N$13
  Top 0.2: U2.26 49.95,4.25 47.9,6.3 XTAL2.P$1 47.9,7.25 C10.2
N$14
  Top 0.2: C9.2 47.55,3.65 XTAL2.P$2 49.5,4 49.8,3.7 50.59,3.7 U2.27
N$17
  Top 0.2: 3V3.A 20.8,39.05 R2.1
N$18
  Top 0.2: U2.17 52.45,8.05 52.7,8.3 55.2,8.3 R8.1
N$19
  Top 0.2: R3.1 5V.A
N$24
  Top 0.2: X5.2 31.5,44.97 31.5,45.5 | R20.2 26.58,48.78 30.22,48.78 31.5,47.5 31.5,45.5 | U3.7 31.34,45.66 31.5,45.5
N$29
  Top 0.2: U3.6 25.77,46.94 J3.2
  Bottom 0.2: J3.2 29.07,44.86 X5.3
RPI_RX
  Top 0.2: JP2.3 31.29,48.81 30.31,49.79 21.08,49.79 19.95,50.91 19.95,51.75 18.53,53.17 K1.10
RPI_SCL  (via drill 0.3)
  Top 0.2: JP4.1 47.59,13.39 v47.8,13.6 | v20.3,49.1 20.05,49.35 19.4,49.35 | 19.4,49.35 18.4,49.35 14.8,49.35 13.45,50.7 K1.5 | R10.1 19.4,49.35
  Bottom 0.2: v47.8,13.6 47.8,14.2 51.15,17.55 51.15,39.59 51.15,42.54 47.89,45.81 37.31,45.81 36.72,45.21 31.49,45.21 27.65,49.05 20.35,49.05 v20.3,49.1
RPI_SDA  (via drill 0.3)
  Top 0.2: JP3.1 47,10.69 47,14.2 v47.5,14.7 | v18.36,48.66 18.22,48.8 17.5,48.8 | K1.3 11.91,51.23 14.34,48.8 17.5,48.8 | R9.1 17.5,48.8
  Bottom 0.2: v47.5,14.7 50.8,18 50.8,39.45 50.8,42.4 47.74,45.46 37.46,45.46 36.86,44.86 31.34,44.86 27.61,48.59 22.99,48.59 22.94,48.54 18.48,48.54 v18.36,48.66
RPI_TX
  Top 0.2: K1.8 17.09,53.77 18.11,52.76 18.44,52.76 19.6,51.6 19.6,50.77 20.93,49.44 30.07,49.44 31.85,47.65 31.85,46.18 32.94,45.09 34.68,45.09 35.01,45.41 JP1.3
RS485_DIR  (via drill 0.3)
  Top 0.2: U3.3 33.81,46.4 33.81,46.3 | 33.81,46.3 U3.2 | U1.21 51.25,36.6 51.25,38.04 50.2,39.09 v50.2,39.16 | v37.49,44.7 37.49,45.63 36.82,46.3 33.81,46.3
  Bottom 0.2: v50.2,39.16 50.4,39.36 50.4,42.3 47.64,45.06 37.85,45.06 v37.49,44.7
SWCLK  (via drill 0.3)
  Top 0.2: v46.7,47.5 46.9,47.7 47.6,47.7 48.3,47 R4.1 48.4,46.5 48.9,46 48.9,44.95 U1.45
  Bottom 0.2: v46.7,47.5 46.5,47.3 38.1,47.3 35.18,50.22 35.18,52.05 33.77,53.47 K1.22
SWDIO  (via drill 0.3)
  Top 0.2: U1.46 48.35,45.83 47.4,46.78 v47.4,47.1
  Bottom 0.2: K1.18 30.06,52.4 34.03,52.4 34.78,51.65 34.78,50.02 37.93,46.87 47.17,46.87 v47.4,47.1
TRIG
  Top 0.2: R13.1 48.7,18.92 Q3.D 51.68,18.42 53.63,16.47 X3.2
  Bottom 0.2: X3.2 X4.2
TRIG_
  Top 0.2: R5.1 50.16,15.56 | 50.16,15.56 50.16,15.4 55.6,15.4 57.7,17.5 57.7,32.7 54.4,36 54.4,37.82 U1.25 | 50.16,15.56 Q3.S
TRIG_B
  Top 0.2: R22.1 49.65,31.35 49.65,31.34 49.7,31.29 Q4.D 50.85,29.47 X1.2
  Bottom 0.2: X8.2 54.1,29.57 X1.2
TRIG_B_
  Top 0.2: Q4.S 50.4,28.32 R18.1 51.5,28.3 54.56,28.3 55.4,29.14 55.4,33.6 52.85,36.15 U1.24
USBD_N  (via drill 0.3)
  Top 0.2: v48.9,41.72 49.13,41.95 U1.33 | v5.9,43.5 5.1,42.7 5.1,41.62 X6.D-
  Bottom 0.2: v5.9,43.5 18.6,43.5 21.65,40.45 24.96,40.45 27.21,38.2 39.69,38.2 43.22,41.72 v48.9,41.72
USBD_P  (via drill 0.3)
  Top 0.2: v48.4,42.38 48.47,42.45 U1.34 | X6.D+ 5.7,42.26 6.8,43.36 v6.8,44.16
  Bottom 0.2: v6.8,44.16 7.1,43.86 18.74,43.86 21.7,40.9 25,40.9 27.35,38.55 39.45,38.55 43.28,42.38 v48.4,42.38

### Text on the board
tPlace: ULTRASONIC
bPlace: 04/05/2020 | Robodeck RPi HAT v1